# EAGLE design Sender (EAGLE 7.3.0)
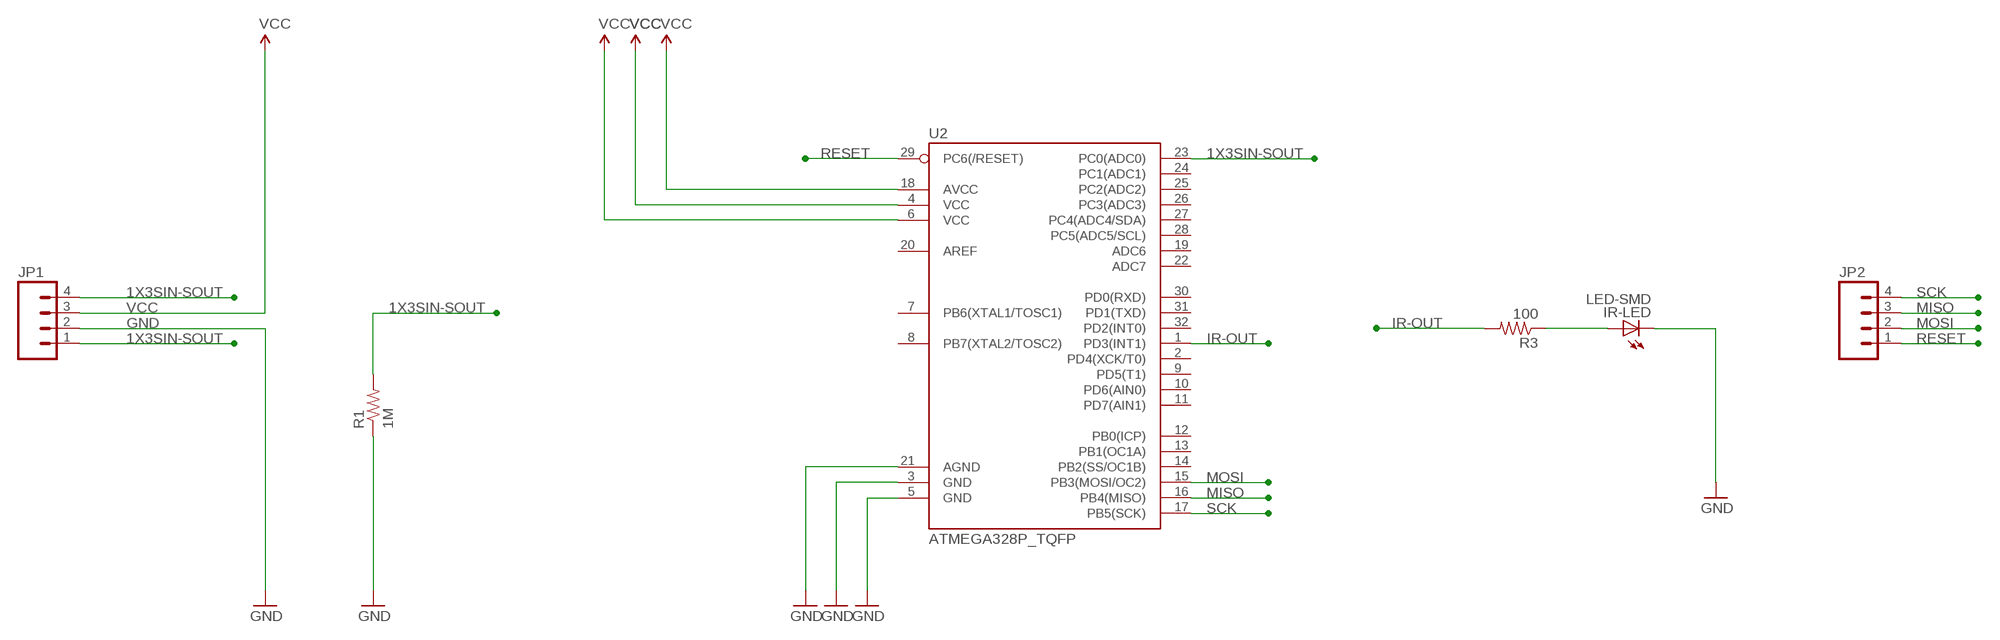
[diagram p0: schematic, sheet 1]

## Parts
IR-LED  LED-SMD  [LED5MM-SMD]
JP1  M04PTH  [1X04]
JP2  M04PTH  [1X04]
R1  1M  R-US_R0603  [R0603]
R3  100  R-US_R0603  [R0603]
U2  ATMEGA328P_TQFP  [TQFP32-08]

## Nets
1X3SIN-SOUT: JP1.1 JP1.4 R1.2 U2.23(PC0(ADC0))
GND: IR-LED.CATHODE(C) JP1.2 R1.1 U2.3(GND) U2.5(GND) U2.21(AGND)
IR-OUT: R3.2 U2.1(PD3(INT1))
MISO: JP2.3 U2.16(PB4(MISO))
MOSI: JP2.2 U2.15(PB3(MOSI/OC2))
N$2: IR-LED.ANODE(A) R3.1
RESET: JP2.1 U2.29(PC6(/RESET))
SCK: JP2.4 U2.17(PB5(SCK))
VCC: JP1.3 U2.4(VCC) U2.6(VCC) U2.18(AVCC)
Unconnected: U2.2(PD4(XCK/T0)) U2.7(PB6(XTAL1/TOSC1)) U2.8(PB7(XTAL2/TOSC2)) U2.9(PD5(T1)) U2.10(PD6(AIN0)) U2.11(PD7(AIN1)) U2.12(PB0(ICP)) U2.13(PB1(OC1A)) U2.14(PB2(SS/OC1B)) U2.19(ADC6) U2.20(AREF) U2.22(ADC7) U2.24(PC1(ADC1)) U2.25(PC2(ADC2)) U2.26(PC3(ADC3)) U2.27(PC4(ADC4/SDA)) U2.28(PC5(ADC5/SCL)) U2.30(PD0(RXD)) U2.31(PD1(TXD)) U2.32(PD2(INT0))

## Library data of the parts
IR-LED = MakerWear:LED-SMD
JP1 JP2 = SparkFun-Connectors:M04: Header 4 Standard 4-pin 0.1" header. Use with straight break away headers (SKU : PRT-00116), right angle break away headers (PRT-00553), swiss pins (PRT-00743), machine pins (PRT-00117), and female headers (PRT-00115). Molex polarized connector foot print use with SKU : PRT-08231 with associated crimp pins and housings. 1MM SMD Version SKU: PRT-10208
R1 R3 = adafruit:R-US_: RESISTOR, American symbol
U2 = SparkFun-DigitalIC:ATMEGA328P_TQFP; PROD_ID: IC-09069

## Board
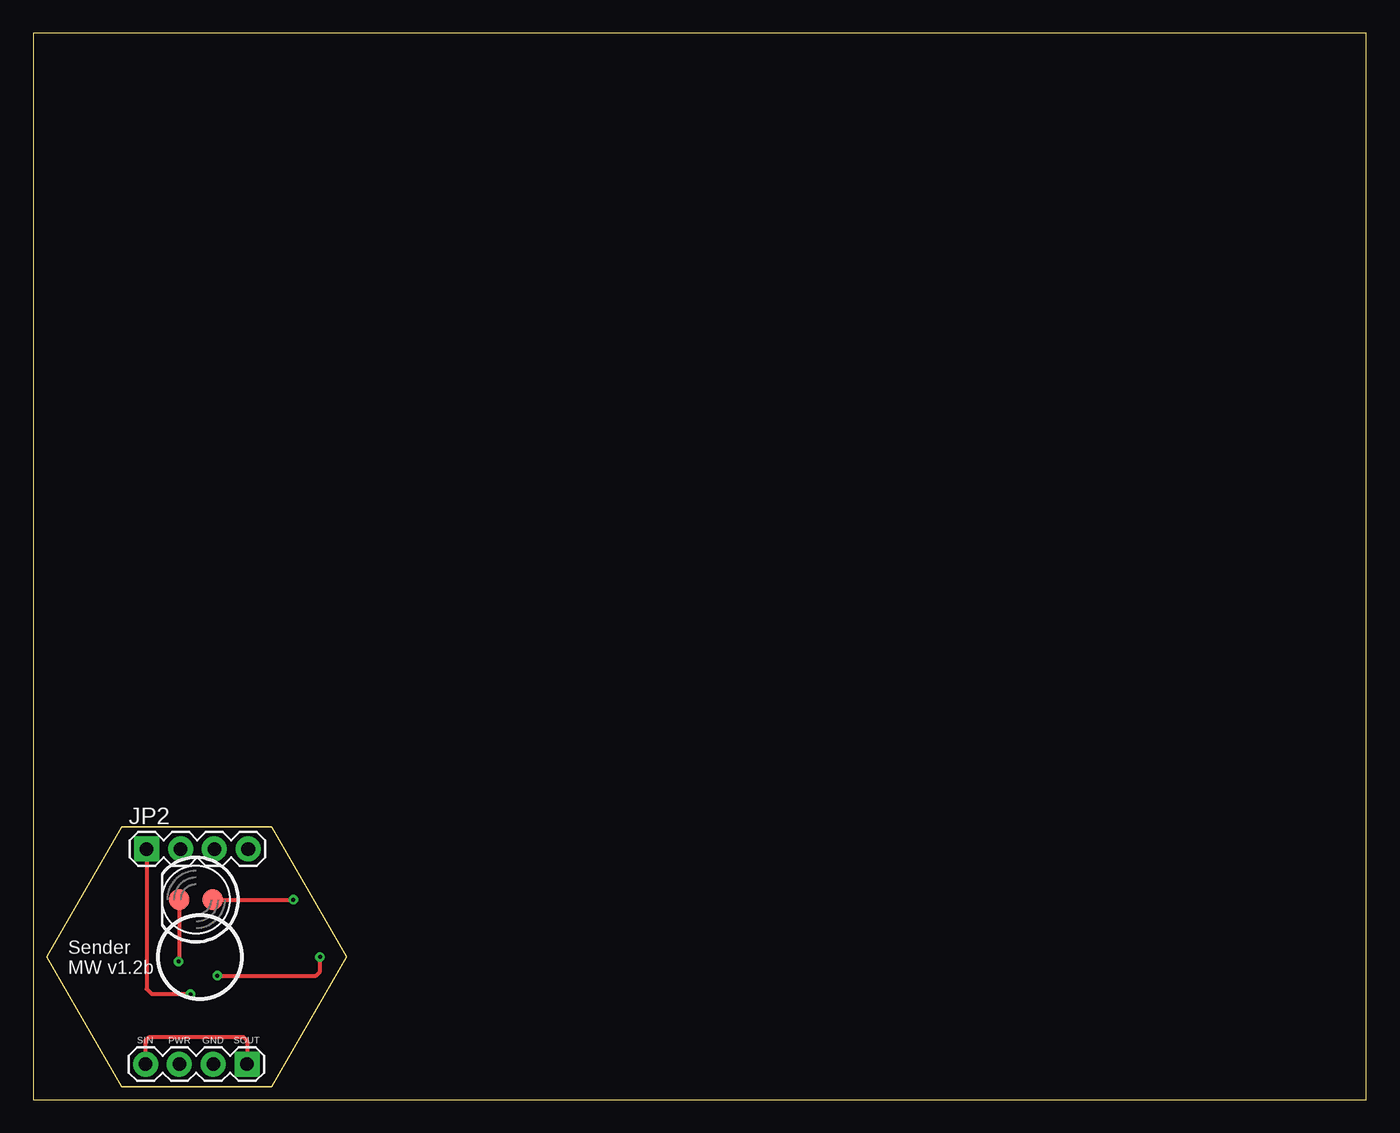
[diagram p1: board, top side]
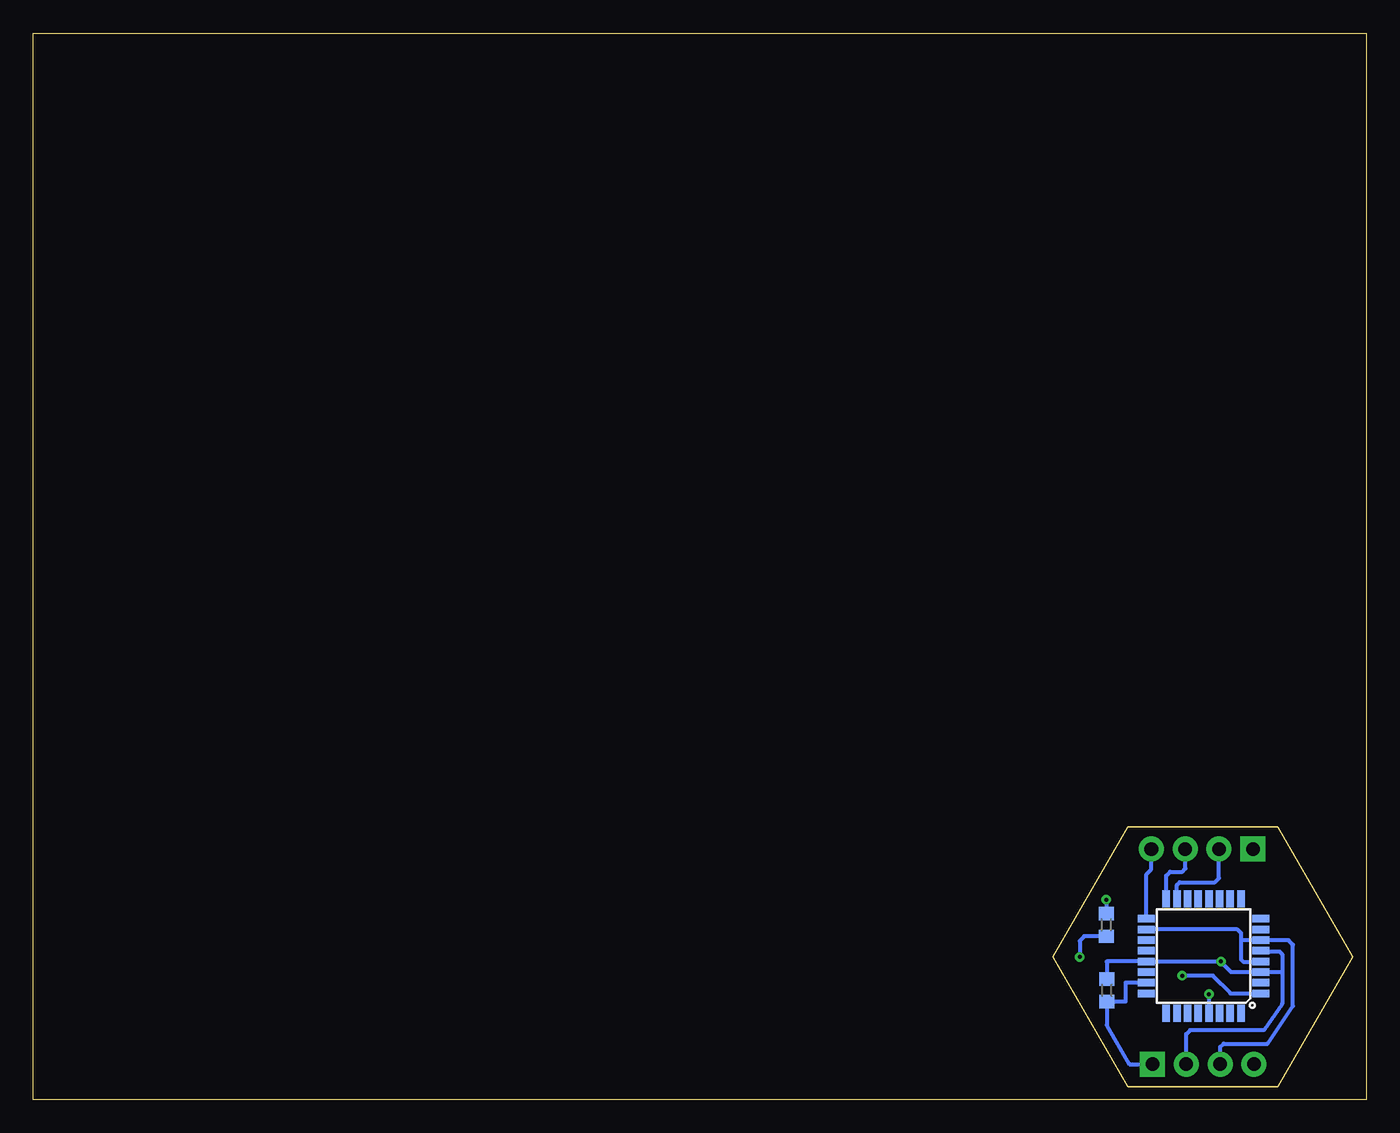
[diagram p2: board, bottom side, seen from below]

Size 100 x 80 mm. Coordinates in mm from the lower left corner, seen from the top.
Outline: 0,0 100,0 100,80 0,80 0,0
Outline: 23.49,10.7 17.86,0.96 6.61,0.96 0.99,10.7 6.61,20.44 17.86,20.44 23.49,10.7
Copper layers (1*16): Top 0.035mm / dielectric 1.5mm / Bottom 0.035mm
Design rules "default *": minimum track width 10mil, minimum drill 24mil, track to track 8mil, track to pad 8mil, pad to pad 8mil, via to via 8mil, smd to smd 8mil, copper to edge 0mil, drill to drill 8mil, minimum pad ring 10mil, minimum via ring 8mil, stop-mask expansion 4mil, vias tented up to drill 0mil, thermal gap 10mil

### Footprints (pad centres in the part's own frame; a part is rotated, then mirrored left to right if it is on the bottom)
LED5MM-SMD = smd 1.524 x 1.524: ANODE -1.27,0; CATHODE 1.27,0
1X04 = drill 1.016 pad 1.88 square: 1 0,0 | drill 1.016 pad 1.88: 2 2.54,0; 3 5.08,0; 4 7.62,0
R0603 = smd 1 x 1.1: 1 -0.85,0; 2 0.85,0
TQFP32-08 = smd 1.27 x 0.559: 1 -4.293,2.8; 2 -4.293,2; 3 -4.293,1.2; 4 -4.293,0.4; 5 -4.293,-0.4; 6 -4.293,-1.2; 7 -4.293,-2; 8 -4.293,-2.8; 17 4.293,-2.8; 18 4.293,-2; 19 4.293,-1.2; 20 4.293,-0.4; 21 4.293,0.4; 22 4.293,1.2; 23 4.293,2; 24 4.293,2.8 | smd 0.559 x 1.27: 9 -2.8,-4.293; 10 -2,-4.293; 11 -1.2,-4.293; 12 -0.4,-4.293; 13 0.4,-4.293; 14 1.2,-4.293; 15 2,-4.293; 16 2.8,-4.293; 25 2.8,4.293; 26 2,4.293; 27 1.2,4.293; 28 0.4,4.293; 29 -0.4,4.293; 30 -1.2,4.293; 31 -2,4.293; 32 -2.8,4.293

### Placement (x,y rotation side)
IR-LED  12.2,15 180 top
JP1  16.04,2.66 180 top
JP2  8.5,18.8 0 top
R1  19.46,8.2 270 bottom
R3  19.5,13.1 270 bottom
U2  12.2,10.76 180 bottom

### Tracks (layer width: path | path; a pad name or v marks a point on that pad's centre or on a via)
1X3SIN-SOUT
  Top 0.305: JP1.4 8.42,4.42 8.7,4.7 15.76,4.7 16.04,4.42 JP1.1
  Bottom 0.305: JP1.1 17.76,2.66 19.46,5.58 R1.2 18.06,7.34 18.06,8.76 U2.23
GND  (via drill 0.3 pad 0.25)
  Top 0.305: IR-LED.CATHODE 10.93,10.39 v10.9,10.36
  Bottom 0.305: R1.1 19.46,10.36 U2.21 10.93,10.36 | v10.9,10.36 10.93,10.36 | 10.93,10.36 10.14,9.57 U2.3 | U2.3 | U2.5 7.85,11.1 6.5,11.1 6.3,10.9 6.3,9.57 | JP1.2 13.5,4.9 13.2,5.2 7.7,5.2 6.3,7.2 6.3,9.57 | U2.3 6.3,9.57
IR-OUT  (via drill 0.3 pad 0.25)
  Top 0.305: v13.8,9.3 21.2,9.3 21.5,9.6 v21.5,10.7
  Bottom 0.305: R3.2 21.15,12.25 21.5,11.9 v21.5,10.7 | U2.1 10.16,7.96 11.5,9.3 v13.8,9.3
MISO
  Bottom 0.305: U2.16 15,16.8 14.7,17.1 13.79,17.1 13.56,17.33 13.56,18.78 JP2.3
MOSI
  Bottom 0.305: U2.15 14.2,16.1 14,16.3 11.34,16.3 11.04,16.6 JP2.2
N$2  (via drill 0.3 pad 0.25)
  Top 0.305: IR-LED.ANODE v19.5,15
  Bottom 0.305: v19.5,15 R3.1
RESET  (via drill 0.3 pad 0.25)
  Top 0.305: JP2.1 8.5,8.3 8.9,7.9 v11.8,7.9
  Bottom 0.305: v11.8,7.9 U2.29
SCK
  Bottom 0.305: U2.17 16.49,16.91 16.13,17.27 JP2.4
VCC
  Bottom 0.305: 9.4,11.9 9.4,12.5 9.66,12.76 U2.18 | 9.4,11.9 9.4,10.53 9.22,10.35 U2.4 | 9.4,11.9 9.34,11.96 U2.6 7.9,11.95 5.84,11.95 5.5,11.61 5.5,7 7.4,4.2 10.7,4.2 10.96,3.94 JP1.3

### Text on the board
tPlace: Sender / MW v1.2b | SIN | PWR | GND | SOUT